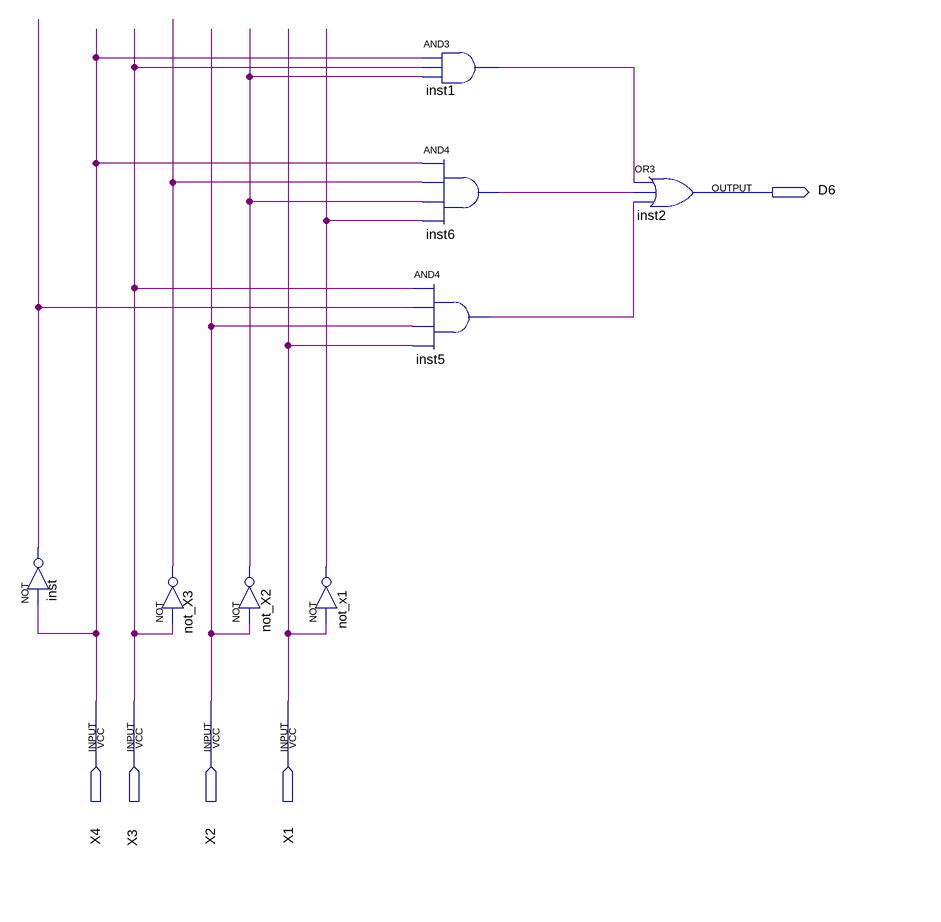
[diagram p0: schematic sheet]
// Quartus schematic conv_D6.bdf as structural Verilog: 8 symbols, 5 pins
module conv_D6 (
  input  X4,
  input  X3,
  input  X2,
  input  X1,
  output D6
);

  wire inst1_out, inst5_out, inst6_out, inst_out, not_x1_out, not_X2_out, not_X3_out;

  not inst (inst_out, X4);
  not not_X3 (not_X3_out, X3);
  not not_X2 (not_X2_out, X2);
  not not_x1 (not_x1_out, X1);
  and inst5 (inst5_out, X3, inst_out, X2, X1);
  and inst1 (inst1_out, X4, X3, not_X2_out);
  and inst6 (inst6_out, X4, not_X3_out, not_X2_out, not_x1_out);
  or inst2 (D6, inst1_out, inst6_out, inst5_out);
endmodule
